# EAGLE schematic ai_aurora (EAGLE 7.1.0)
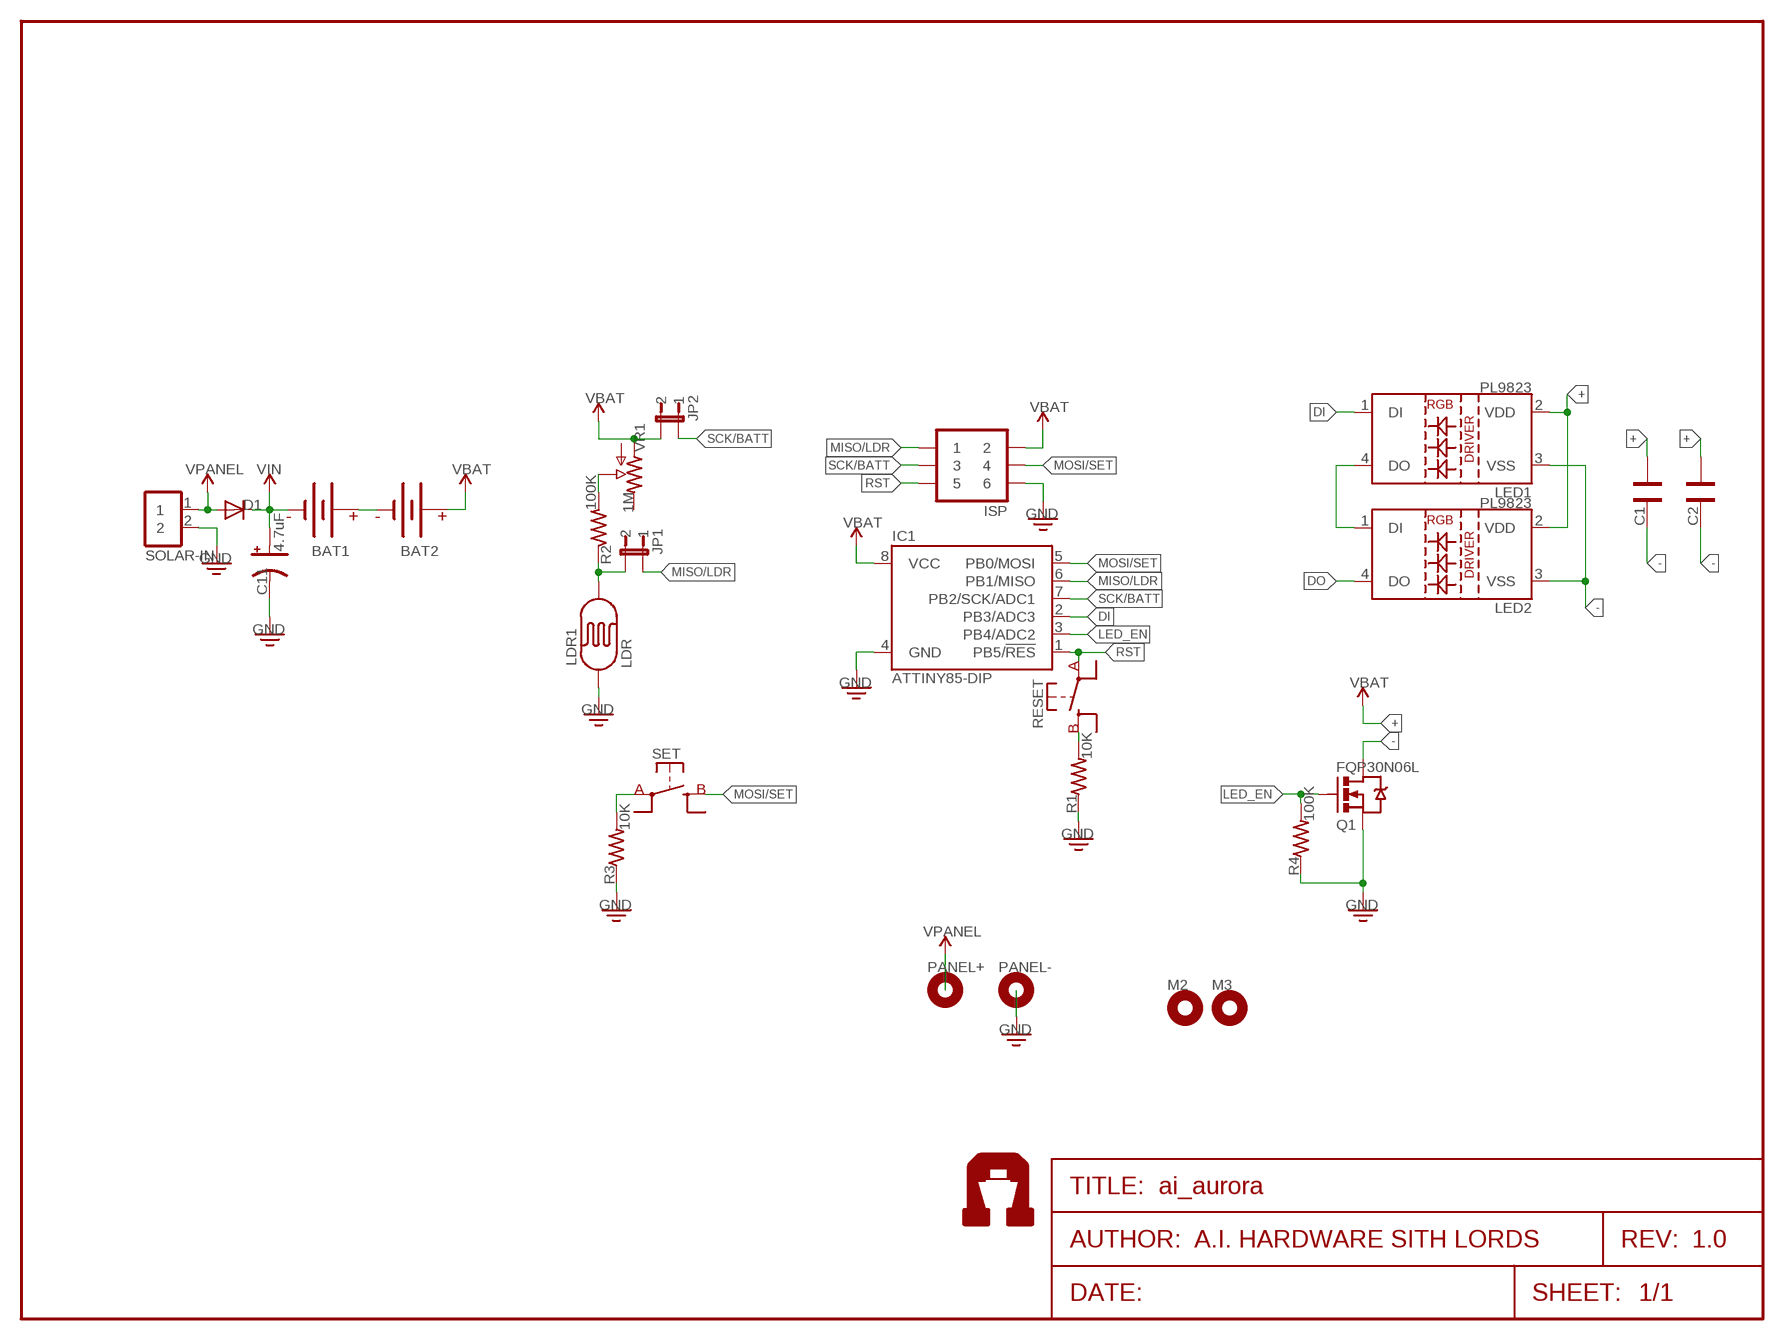
[diagram p0: schematic, sheet 1]
FRAME1 (FRAME-LETTER): AUTHOR: A.I. HARDWARE SITH LORDS; REV: 1.0

## Parts
BAT1  BATTERY-HOLDERCR123A  [BATTERY-CR123A]
BAT2  BATTERY-HOLDERCR123A  [BATTERY-CR123A]
C1  CAP025X050  [CAP-025X050]
C2  CAP025X050  [CAP-025X050]
C11  4.7uF  CAP-POL025X50  [CAP-POL-025X50]
D1  DIODETH-1N914  [TH-1N914]
IC1  ATTINY85-DIP  [DIL08]
ISP  2X03  [2X03]
JP1  1X02-PJ  [1X02]
JP2  1X02-PJ  [1X02]
LDR1  LDR-PTH  [LDR]
LED1  LED-PL9823-F8  [LED-PL9823-F8]
LED2  LED-PL9823-F8  [LED-PL9823-F8]
M2  1X01-TERM-PANEL  [1X01-PANEL]
M3  1X01-TERM-PANEL  [1X01-PANEL]
PANEL+  1X01-TERM-PANEL  [1X01-PANEL]
PANEL-  1X01-TERM-PANEL  [1X01-PANEL]
Q1  FQP30N06L  FET-NMOS-FQP30N06L  [TO-220]
R1  10K  RESAXIAL-0.4  [RES-AXIAL-0.4]
R2  100K  RESAXIAL-0.4  [RES-AXIAL-0.4]
R3  10K  RESAXIAL-0.4  [RES-AXIAL-0.4]
R4  100K  RESAXIAL-0.4  [RES-AXIAL-0.4]
RESET  SW-SPSTTH06X06  [SW-SPST-TH06X06]
SET  SW-SPSTTH06X06  [SW-SPST-TH06X06]
SOLAR-IN  1X02ST  [1X02-ST]
U$4  AI-LOGOM  [AI-LOGO-M]
U$5  AI-LOGOM  [AI-LOGO-M]
VR1  1M  POT05X05  [POT-05X05]

## Nets
+: C1.1 C2.1 LED1.2(VDD) LED2.2(VDD) ; supply symbol labelled VBAT
-: C1.2 C2.2 LED1.3(VSS) LED2.3(VSS) Q1.2(D)
DI: IC1.2(PB3/ADC3) LED1.1(DI)
DO: LED2.4(DO)
GND: C11.C IC1.4(GND) ISP.6 LDR1.1 PANEL-.1 Q1.3(S) R1.P$1 R3.P$1 R4.P$1 SOLAR-IN.2
LED_EN: IC1.3(PB4/ADC2) Q1.1(G) R4.P$2
MISO/LDR: IC1.6(PB1/MISO) ISP.1 JP1.1
MOSI/SET: IC1.5(PB0/MOSI) ISP.4 SET.B@1(B)
N$1: BAT1.+ BAT2.-
N$3: R1.P$2 RESET.B@1(B)
N$4: LED1.4(DO) LED2.1(DI)
N$5: R3.P$2 SET.A@1(A)
N$6: R2.P$2 VR1.2(S)
N$7: JP1.2 LDR1.2 R2.P$1
RST: IC1.1(PB5/!RES) ISP.5 RESET.A@1(A)
SCK/BATT: IC1.7(PB2/SCK/ADC1) ISP.3 JP2.1
VBAT: BAT2.+ IC1.8(VCC) ISP.2 JP2.2 VR1.3(A)
VIN: BAT1.- C11.A D1.C
VPANEL: D1.A PANEL+.1 SOLAR-IN.1
Unconnected: M2.1 M3.1 VR1.1(E)

## Library data of the parts
BAT1 BAT2 = Ai_Electromechanical:BATTERY-HOLDER
C1 C2 = Ai_Passives:CAP
C11 = Ai_Passives:CAP-POL: Polarized Capacitor Normally 10uF, 47uF, and 100uF in electrolytic and tantalum varieties.
D1 = Ai_DiscreteSemis:DIODE
IC1 = Ai_IC:ATTINY: Atmel's 8-pin 2/4/8kB flash family of microcontrollers
ISP = Ai_Connectors:2X03
JP1 JP2 = Ai_Connectors:1X02-PJ
LDR1 = Ai_Sensors:LDR
LED1 LED2 = Ai_LED:LED-PL9823
M2 M3 PANEL+ PANEL- = Ai_Connectors:1X01-TERM
Q1 = Ai_DiscreteSemis:FET-NMOS
R1-R4 = Ai_Passives:RES: Part # blah Digikey
RESET SET = Ai_Electromechanical:SW-SPST
SOLAR-IN = Ai_Connectors:1X02
U$4 U$5 = Ai_Miscellany:AI-LOGO
VR1 = Ai_Passives:POT